# EAGLE design Placa Final (EAGLE 7.6.0)

## Sheet 1 of 10
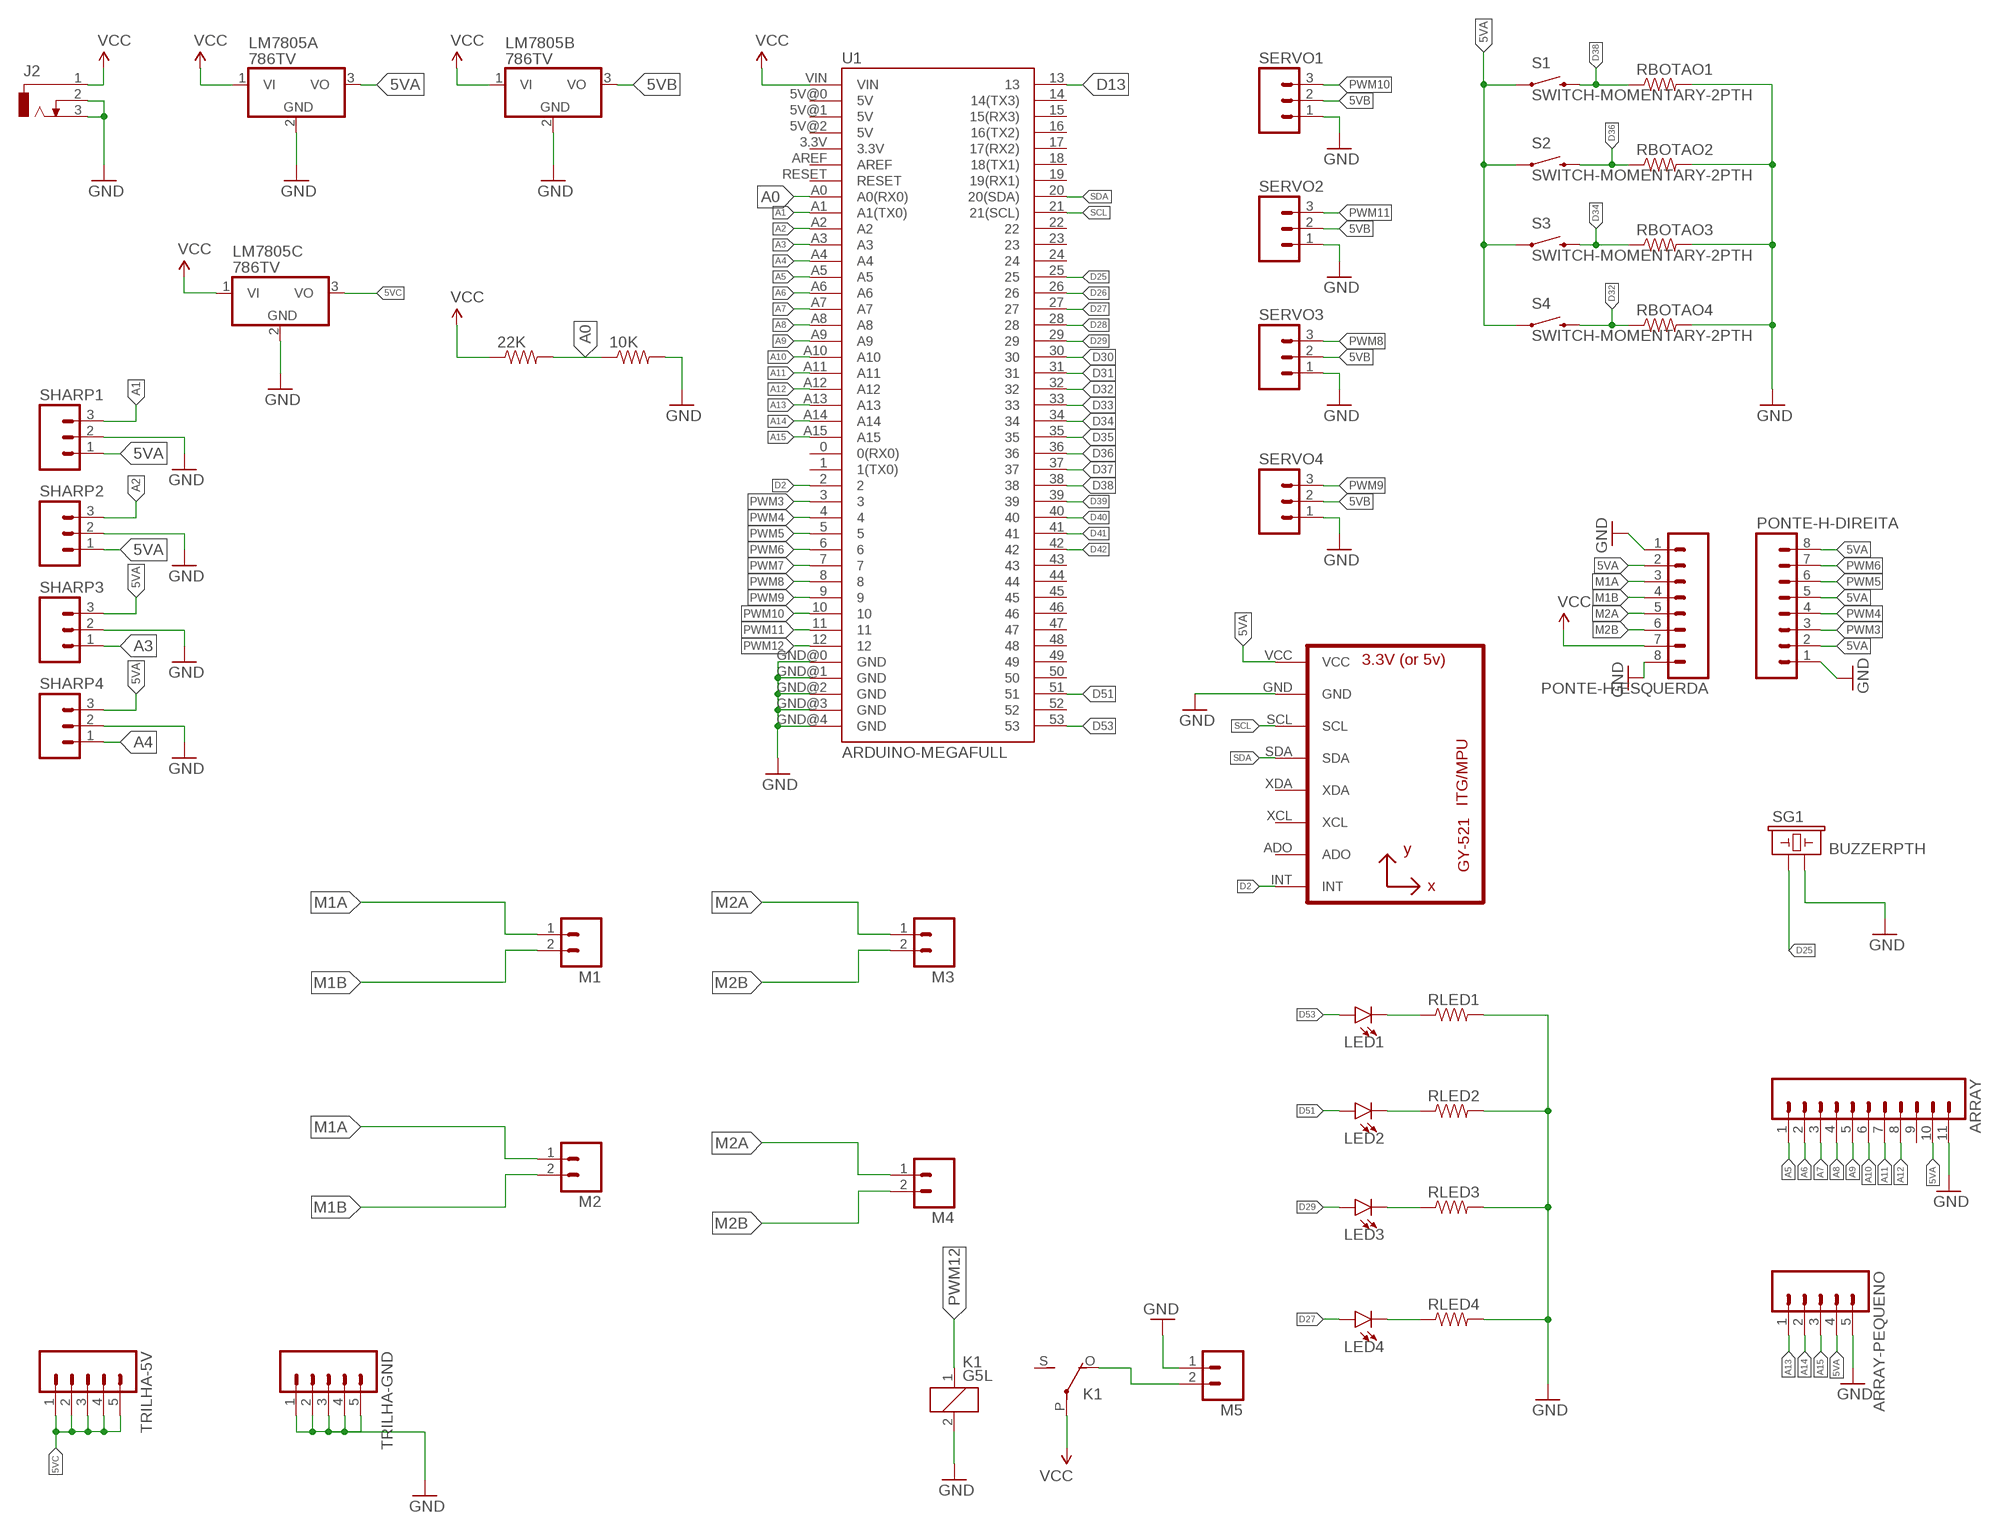
[diagram p0: schematic, sheet 1]

### Parts
10K  RESISTOREZ  [AXIAL-0.3EZ]
22K  RESISTOREZ  [AXIAL-0.3EZ]
ARRAY  M11POGOPIN_HOLES_ONLY  [1X11_HOLES_ONLY]
ARRAY-PEQUENO  M05PTH  [1X05]
J2  DCJ0303  [DCJ0303]
K1  G5L  [G5LE]
LED1  LED5MM  [LED_5MM]
LED2  LED5MM  [LED_5MM]
LED3  LED5MM  [LED_5MM]
LED4  LED5MM  [LED_5MM]
LM7805A  786TV  [TO220V]
LM7805B  786TV  [TO220V]
LM7805C  786TV  [TO220V]
M1  M02JST-PTH-VERT  [JST-2-PTH-VERT]
M2  M02JST-PTH-VERT  [JST-2-PTH-VERT]
M3  M02JST-PTH-VERT  [JST-2-PTH-VERT]
M4  M02JST-PTH-VERT  [JST-2-PTH-VERT]
M5  M02JST-PTH-VERT  [JST-2-PTH-VERT]
PONTE-H-DIREITA  M08NO_SILK  [1X08_PIN1_NO_SILK]
PONTE-H-ESQUERDA  M08NO_SILK  [1X08_PIN1_NO_SILK]
RBOTAO1  RESISTOREZ  [AXIAL-0.3EZ]
RBOTAO2  RESISTOREZ  [AXIAL-0.3EZ]
RBOTAO3  RESISTOREZ  [AXIAL-0.3EZ]
RBOTAO4  RESISTOREZ  [AXIAL-0.3EZ]
RLED1  RESISTOREZ  [AXIAL-0.3EZ]
RLED2  RESISTOREZ  [AXIAL-0.3EZ]
RLED3  RESISTOREZ  [AXIAL-0.3EZ]
RLED4  RESISTOREZ  [AXIAL-0.3EZ]
S1  SWITCH-MOMENTARY-2PTH  [TACTILE-PTH]
S2  SWITCH-MOMENTARY-2PTH  [TACTILE-PTH]
S3  SWITCH-MOMENTARY-2PTH  [TACTILE-PTH]
S4  SWITCH-MOMENTARY-2PTH  [TACTILE-PTH]
SERVO1  M03LONGPADS  [1X03_LONGPADS@1]
SERVO2  M03LONGPADS  [1X03_LONGPADS@1]
SERVO3  M03LONGPADS  [1X03_LONGPADS@1]
SERVO4  M03LONGPADS  [1X03_LONGPADS@1]
SG1  BUZZERPTH  [BUZZER-12MM]
SHARP1  M03LONGPADS  [1X03_LONGPADS@1]
SHARP2  M03LONGPADS  [1X03_LONGPADS@1]
SHARP3  M03LONGPADS  [1X03_LONGPADS@1]
SHARP4  M03LONGPADS  [1X03_LONGPADS@1]
TRILHA-5V  M05PTH  [1X05]
TRILHA-GND  M05PTH  [1X05]
U1  ARDUINO-MEGAFULL  [ARDUINO_MEGA]
U2  GY-521MPU6050  [GY-521]

### Nets
5VA: ARRAY-PEQUENO.4 ARRAY.10 LM7805A.3(VO) PONTE-H-DIREITA.2 PONTE-H-DIREITA.5 PONTE-H-DIREITA.8 PONTE-H-ESQUERDA.2 S1.1 S2.1 S3.1 S4.1 SHARP1.1 SHARP2.1 SHARP3.3 SHARP4.3 U2.VCC
5VB: LM7805B.3(VO) SERVO1.2 SERVO2.2 SERVO3.2 SERVO4.2
5VC: LM7805C.3(VO) TRILHA-5V.1 TRILHA-5V.2 TRILHA-5V.3 TRILHA-5V.4 TRILHA-5V.5
A0: 10K.P$1 22K.P$2 U1.A0(A0(RX0))
A1: SHARP1.3 U1.A1(A1(TX0))
A2: SHARP2.3 U1.A2
A3: SHARP3.1 U1.A3
A4: SHARP4.1 U1.A4
A5: ARRAY.1 U1.A5
A6: ARRAY.2 U1.A6
A7: ARRAY.3 U1.A7
A8: ARRAY.4 U1.A8
A9: ARRAY.5 U1.A9
A10: ARRAY.6 U1.A10
A11: ARRAY.7 U1.A11
A12: ARRAY.8 U1.A12
A13: ARRAY-PEQUENO.1 U1.A13
A14: ARRAY-PEQUENO.2 U1.A14
A15: ARRAY-PEQUENO.3 U1.A15
D2: U1.2 U2.INT
D13: U1.13
D25: SG1.+ U1.25
D26: U1.26
D27: LED4.A U1.27
D28: U1.28
D29: LED3.A U1.29
D30: U1.30
D31: U1.31
D32: RBOTAO4.P$1 S4.3 U1.32
D33: U1.33
D34: RBOTAO3.P$1 S3.3 U1.34
D35: U1.35
D36: RBOTAO2.P$1 S2.3 U1.36
D37: U1.37
D38: RBOTAO1.P$1 S1.3 U1.38
D39: U1.39
D40: U1.40
D41: U1.41
D42: U1.42
D51: LED2.A U1.51
D53: LED1.A U1.53
GND: 10K.P$2 ARRAY-PEQUENO.5 ARRAY.11 J2.2 J2.3 K1.2 LM7805A.2(GND) LM7805B.2(GND) LM7805C.2(GND) M5.1 PONTE-H-DIREITA.1 PONTE-H-ESQUERDA.1 PONTE-H-ESQUERDA.8 RBOTAO1.P$2 RBOTAO2.P$2 RBOTAO3.P$2 RBOTAO4.P$2 RLED1.P$2 RLED2.P$2 RLED3.P$2 RLED4.P$2 SERVO1.1 SERVO2.1 SERVO3.1 SERVO4.1 SG1.- SHARP1.2 SHARP2.2 SHARP3.2 SHARP4.2 TRILHA-GND.1 TRILHA-GND.2 TRILHA-GND.3 TRILHA-GND.4 TRILHA-GND.5 U1.GND@0(GND) U1.GND@1(GND) U1.GND@2(GND) U1.GND@3(GND) U1.GND@4(GND) U2.GND
M1A: M1.1 M2.1 PONTE-H-ESQUERDA.3
M1B: M1.2 M2.2 PONTE-H-ESQUERDA.4
M2A: M3.1 M4.1 PONTE-H-ESQUERDA.5
M2B: M3.2 M4.2 PONTE-H-ESQUERDA.6
N$1: LED1.K(C) RLED1.P$1
N$2: LED2.K(C) RLED2.P$1
N$3: LED3.K(C) RLED3.P$1
N$4: LED4.K(C) RLED4.P$1
N$41: K1.O(2:O) M5.2
PWM3: PONTE-H-DIREITA.3 U1.3
PWM4: PONTE-H-DIREITA.4 U1.4
PWM5: PONTE-H-DIREITA.6 U1.5
PWM6: PONTE-H-DIREITA.7 U1.6
PWM7: U1.7
PWM8: SERVO3.3 U1.8
PWM9: SERVO4.3 U1.9
PWM10: SERVO1.3 U1.10
PWM11: SERVO2.3 U1.11
PWM12: K1.1 U1.12
SCL: U1.21(21(SCL)) U2.SCL
SDA: U1.20(20(SDA)) U2.SDA
VCC: 22K.P$1 J2.1 K1.P(2:P) LM7805A.1(VI) LM7805B.1(VI) LM7805C.1(VI) PONTE-H-ESQUERDA.7 U1.VIN
Unconnected: ARRAY.9 K1.S(2:S) U1.0(0(RX0)) U1.1(1(TX0)) U1.3.3V U1.5V@0(5V) U1.5V@1(5V) U1.5V@2(5V) U1.14(14(TX3)) U1.15(15(RX3)) U1.16(16(TX2)) U1.17(17(RX2)) U1.18(18(TX1)) U1.19(19(RX1)) U1.22 U1.23 U1.24 U1.43 U1.44 U1.45 U1.46 U1.47 U1.48 U1.49 U1.50 U1.52 U1.AREF U1.RESET U2.ADO U2.XCL U2.XDA

## Sheet 2 of 10
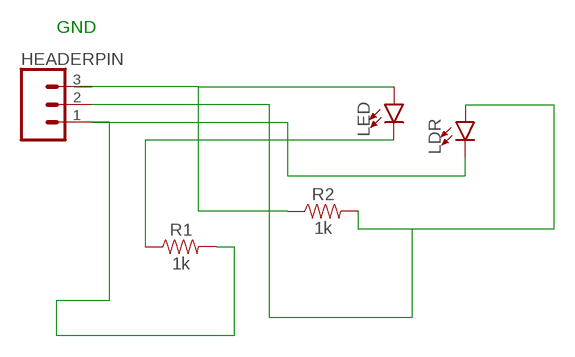
[diagram p1: schematic, sheet 2]

### Parts
HEADERPIN  CONN_03  [1X03]
LDR  LED5MM  [LED_5MM]
LED  LED5MM  [LED_5MM]
R1  1k  1KOHM-HORIZ-1/4W-5%  [AXIAL-0.3]
R2  1k  1KOHM-HORIZ-1/4W-5%  [AXIAL-0.3]

### Nets
N$5: HEADERPIN.3 LED.A R2.P$1
N$6: LED.K(C) R1.P$1
N$7: HEADERPIN.1 LDR.K(C) R1.P$2
N$8: HEADERPIN.2 LDR.A R2.P$2

### Notes on the sheet
- GND

## Sheet 3 of 10
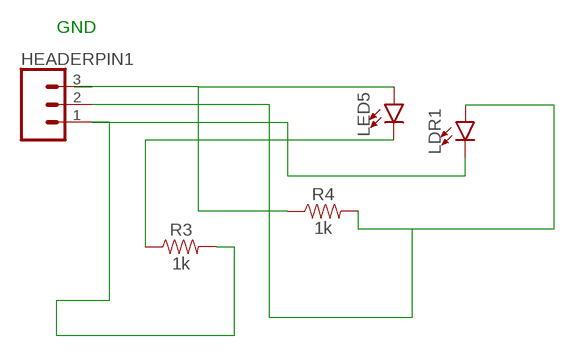
[diagram p2: schematic, sheet 3]

### Parts
HEADERPIN1  CONN_03  [1X03]
LDR1  LED5MM  [LED_5MM]
LED5  LED5MM  [LED_5MM]
R3  1k  1KOHM-HORIZ-1/4W-5%  [AXIAL-0.3]
R4  1k  1KOHM-HORIZ-1/4W-5%  [AXIAL-0.3]

### Nets
N$9: HEADERPIN1.3 LED5.A R4.P$1
N$10: LED5.K(C) R3.P$1
N$11: HEADERPIN1.1 LDR1.K(C) R3.P$2
N$12: HEADERPIN1.2 LDR1.A R4.P$2

### Notes on the sheet
- GND

## Sheet 4 of 10
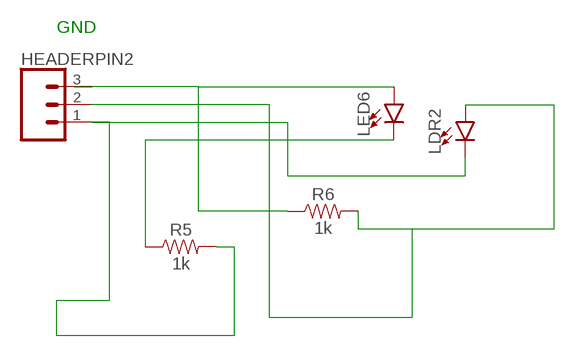
[diagram p3: schematic, sheet 4]

### Parts
HEADERPIN2  CONN_03  [1X03]
LDR2  LED5MM  [LED_5MM]
LED6  LED5MM  [LED_5MM]
R5  1k  1KOHM-HORIZ-1/4W-5%  [AXIAL-0.3]
R6  1k  1KOHM-HORIZ-1/4W-5%  [AXIAL-0.3]

### Nets
N$13: HEADERPIN2.3 LED6.A R6.P$1
N$14: LED6.K(C) R5.P$1
N$15: HEADERPIN2.1 LDR2.K(C) R5.P$2
N$16: HEADERPIN2.2 LDR2.A R6.P$2

### Notes on the sheet
- GND

## Sheet 5 of 10
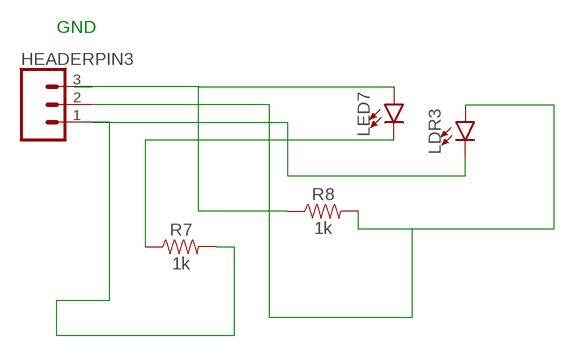
[diagram p4: schematic, sheet 5]

### Parts
HEADERPIN3  CONN_03  [1X03]
LDR3  LED5MM  [LED_5MM]
LED7  LED5MM  [LED_5MM]
R7  1k  1KOHM-HORIZ-1/4W-5%  [AXIAL-0.3]
R8  1k  1KOHM-HORIZ-1/4W-5%  [AXIAL-0.3]

### Nets
N$17: HEADERPIN3.3 LED7.A R8.P$1
N$18: LED7.K(C) R7.P$1
N$19: HEADERPIN3.1 LDR3.K(C) R7.P$2
N$20: HEADERPIN3.2 LDR3.A R8.P$2

### Notes on the sheet
- GND

## Sheet 6 of 10
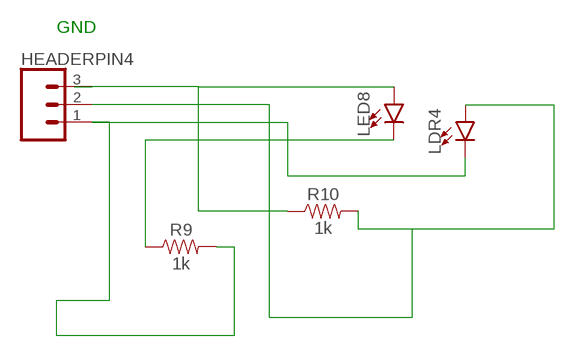
[diagram p5: schematic, sheet 6]

### Parts
HEADERPIN4  CONN_03  [1X03]
LDR4  LED5MM  [LED_5MM]
LED8  LED5MM  [LED_5MM]
R9  1k  1KOHM-HORIZ-1/4W-5%  [AXIAL-0.3]
R10  1k  1KOHM-HORIZ-1/4W-5%  [AXIAL-0.3]

### Nets
N$21: HEADERPIN4.3 LED8.A R10.P$1
N$22: LED8.K(C) R9.P$1
N$23: HEADERPIN4.1 LDR4.K(C) R9.P$2
N$24: HEADERPIN4.2 LDR4.A R10.P$2

### Notes on the sheet
- GND

## Sheet 7 of 10
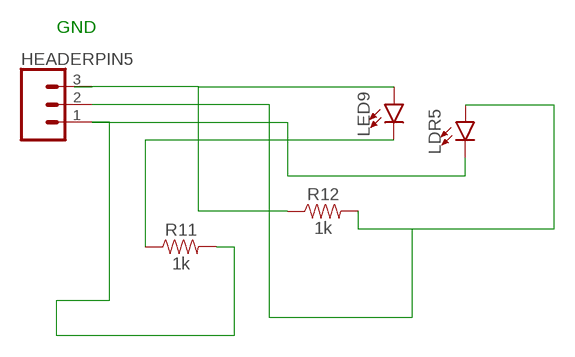
[diagram p6: schematic, sheet 7]

### Parts
HEADERPIN5  CONN_03  [1X03]
LDR5  LED5MM  [LED_5MM]
LED9  LED5MM  [LED_5MM]
R11  1k  1KOHM-HORIZ-1/4W-5%  [AXIAL-0.3]
R12  1k  1KOHM-HORIZ-1/4W-5%  [AXIAL-0.3]

### Nets
N$25: HEADERPIN5.3 LED9.A R12.P$1
N$26: LED9.K(C) R11.P$1
N$27: HEADERPIN5.1 LDR5.K(C) R11.P$2
N$28: HEADERPIN5.2 LDR5.A R12.P$2

### Notes on the sheet
- GND

## Sheet 8 of 10
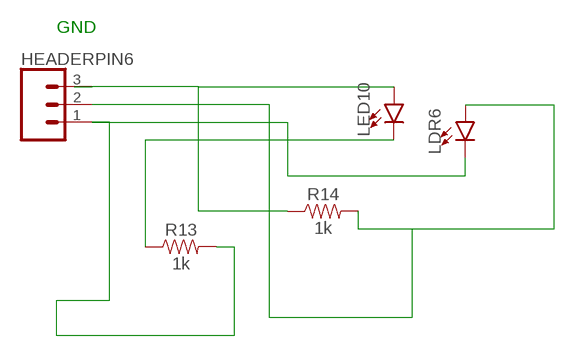
[diagram p7: schematic, sheet 8]

### Parts
HEADERPIN6  CONN_03  [1X03]
LDR6  LED5MM  [LED_5MM]
LED10  LED5MM  [LED_5MM]
R13  1k  1KOHM-HORIZ-1/4W-5%  [AXIAL-0.3]
R14  1k  1KOHM-HORIZ-1/4W-5%  [AXIAL-0.3]

### Nets
N$29: HEADERPIN6.3 LED10.A R14.P$1
N$30: LED10.K(C) R13.P$1
N$31: HEADERPIN6.1 LDR6.K(C) R13.P$2
N$32: HEADERPIN6.2 LDR6.A R14.P$2

### Notes on the sheet
- GND

## Sheet 9 of 10
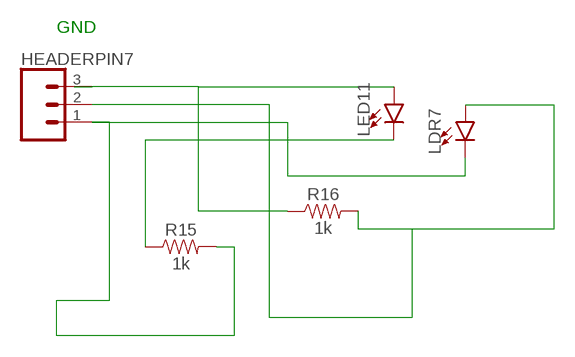
[diagram p8: schematic, sheet 9]

### Parts
HEADERPIN7  CONN_03  [1X03]
LDR7  LED5MM  [LED_5MM]
LED11  LED5MM  [LED_5MM]
R15  1k  1KOHM-HORIZ-1/4W-5%  [AXIAL-0.3]
R16  1k  1KOHM-HORIZ-1/4W-5%  [AXIAL-0.3]

### Nets
N$33: HEADERPIN7.3 LED11.A R16.P$1
N$34: LED11.K(C) R15.P$1
N$35: HEADERPIN7.1 LDR7.K(C) R15.P$2
N$36: HEADERPIN7.2 LDR7.A R16.P$2

### Notes on the sheet
- GND

## Sheet 10 of 10
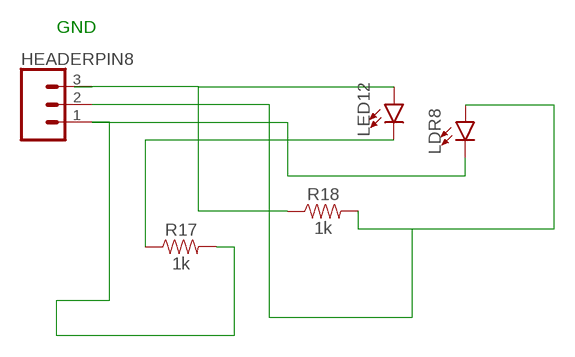
[diagram p9: schematic, sheet 10]

### Parts
HEADERPIN8  CONN_03  [1X03]
LDR8  LED5MM  [LED_5MM]
LED12  LED5MM  [LED_5MM]
R17  1k  1KOHM-HORIZ-1/4W-5%  [AXIAL-0.3]
R18  1k  1KOHM-HORIZ-1/4W-5%  [AXIAL-0.3]

### Nets
N$37: HEADERPIN8.3 LED12.A R18.P$1
N$38: LED12.K(C) R17.P$1
N$39: HEADERPIN8.1 LDR8.K(C) R17.P$2
N$40: HEADERPIN8.2 LDR8.A R18.P$2

### Notes on the sheet
- GND

## Library data of the parts
10K 22K RBOTAO1-RBOTAO4 RLED1-RLED4 = SparkFun-Passives:RESISTOR: Resistor Basic schematic elements and footprints for 0603, 1206, and PTH resistors.
ARRAY = SparkFun-Connectors:M11: Header 11 Standard 11-pin 0.1" header. Use with straight break away headers (SKU : PRT-00116), right angle break away headers (PRT-00553), swiss pins (PRT-00743), machine pins (PRT-00117), and female headers (PRT-00115).
ARRAY-PEQUENO TRILHA-5V TRILHA-GND = SparkFun-Connectors:M05: Header 5 Standard 5-pin 0.1" header. Use with straight break away headers (SKU : PRT-00116), right angle break away headers (PRT-00553), swiss pins (PRT-00743), machine pins (PRT-00117), and female headers (PRT-00115). Molex polarized connector foot print use with SKU : PRT-08230 with associated crimp pins and housings.
HEADERPIN HEADERPIN1-HEADERPIN8 = SparkFun-Connectors:CONN_03: Multi connection point. Often used as Generic Header-pin footprint for 0.1 inch spaced/style header connections On any of the 0.1 inch spaced packages, you can populate with these: Break Away Headers - Straight <https://www.sparkfun.com/products/116> (PRT-00116) Break Away Male Headers - Right Angle <https://www.sparkfun.com/products/553> (PRT-00553) Female Headers <https://www.sparkfun.com/products/115> (PRT-00115) Break Away Headers - Machine Pin <https://www.sparkfun.com/products/117> (PRT-00117) Break Away Female Headers - Swiss Machine Pin <https://www.sparkfun.com/products/743> (PRT-00743) Stackable Header - 3 Pin (Female, 0.1") <https://www.sparkfun.com/products/13875> (PRT-13875) For SCREWTERMINALS and SPRING TERMINALS visit here: Screw Terimnals on SparkFun.com <https://www.sparkfun.com/search/results?term=Screw+Terminals> (5mm/3.5mm/2.54mm spacing) This device is also useful as a general connection point to wire up your design to another part of your project. Our various solder wires solder well into these plated through hole pads. Hook-Up Wire - Assortment (Stranded, 22 AWG) <https://www.sparkfun.com/products/11375> (PRT-11375) Hook-Up Wire - Assortment (Solid Core, 22 AWG) <https://www.sparkfun.com/products/11367> (PRT-11367) View the entire wire category on our website here <https://www.sparkfun.com/categories/141> Special notes: Molex polarized connector foot print use with SKU : PRT-08232 with associated crimp pins and housings.
J2 = con-jack:DCJ0303: DC POWER JACK Source: DCJ0303.pdf; OC_FARNELL: unknown; OC_NEWARK: unknown
K1 = relay:G5L: RELAY 1 x switch, 10 A/120 V AC, 8 A/30 V ADC, Omron
LDR LDR1-LDR8 LED LED1-LED12 = SparkFun-LED:LED: LED (Generic) Standard schematic elements and footprints for 5mm, 3mm, 1206, and 0603 sized LEDs. Generic LEDs with no color specified.
LM7805A LM7805B LM7805C = linear:78*: Positive VOLTAGE REGULATOR Source: http://cache.national.com/ds/LM/LM78L05.pdf http://www.fairchildsemi.com/ds/LM/LM7805.pdf
M1-M5 = SparkFun-Connectors:M02: Standard 2-pin 0.1" header. Use with - straight break away headers ( PRT-00116) - right angle break away headers (PRT-00553) - swiss pins (PRT-00743) - machine pins (PRT-00117) - female headers (PRT-00115) Molex polarized connector foot print use with: PRT-08233 with associated crimp pins and housings. 2.54_SCREWTERM for use with PRT-10571. 3.5mm Screw Terminal footprints for PRT-08084 5mm Screw Terminal footprints for use with PRT-08432
PONTE-H-DIREITA PONTE-H-ESQUERDA = SparkFun-Connectors:M08: Header 8 Standard 8-pin 0.1" header. Use with straight break away headers (SKU : PRT-00116), right angle break away headers (PRT-00553), swiss pins (PRT-00743), machine pins (PRT-00117), and female headers (PRT-00115).
R1-R18 = SparkFun-Resistors:1KOHM: 1kΩ resistor A resistor is a passive two-terminal electrical component that implements electrical resistance as a circuit element. Resistors act to reduce current flow, and, at the same time, act to lower voltage levels within circuits. - Wikipedia; PROD_ID: RES-08380
S1-S4 = SparkFun-Electromechanical:SWITCH-MOMENTARY-2: Various NO switches- pushbuttons, reed, etc; PROD_ID: SWCH-08441
SERVO1-SERVO4 SHARP1-SHARP4 = SparkFun-Connectors:M03: Header 3 Standard 3-pin 0.1" header. Use with straight break away headers (SKU : PRT-00116), right angle break away headers (PRT-00553), swiss pins (PRT-00743), machine pins (PRT-00117), and female headers (PRT-00115). Molex polarized connector foot print use with SKU : PRT-08232 with associated crimp pins and housings.
SG1 = SparkFun-Electromechanical:BUZZER: Buzzer 12mm Spark Fun Electronics SKU : Comp-Buzzer
U1 = SparkFun-Boards:ARDUINO-MEGA: Arduino Mega board footprint
U2 = gy-521:GY-521

## Board
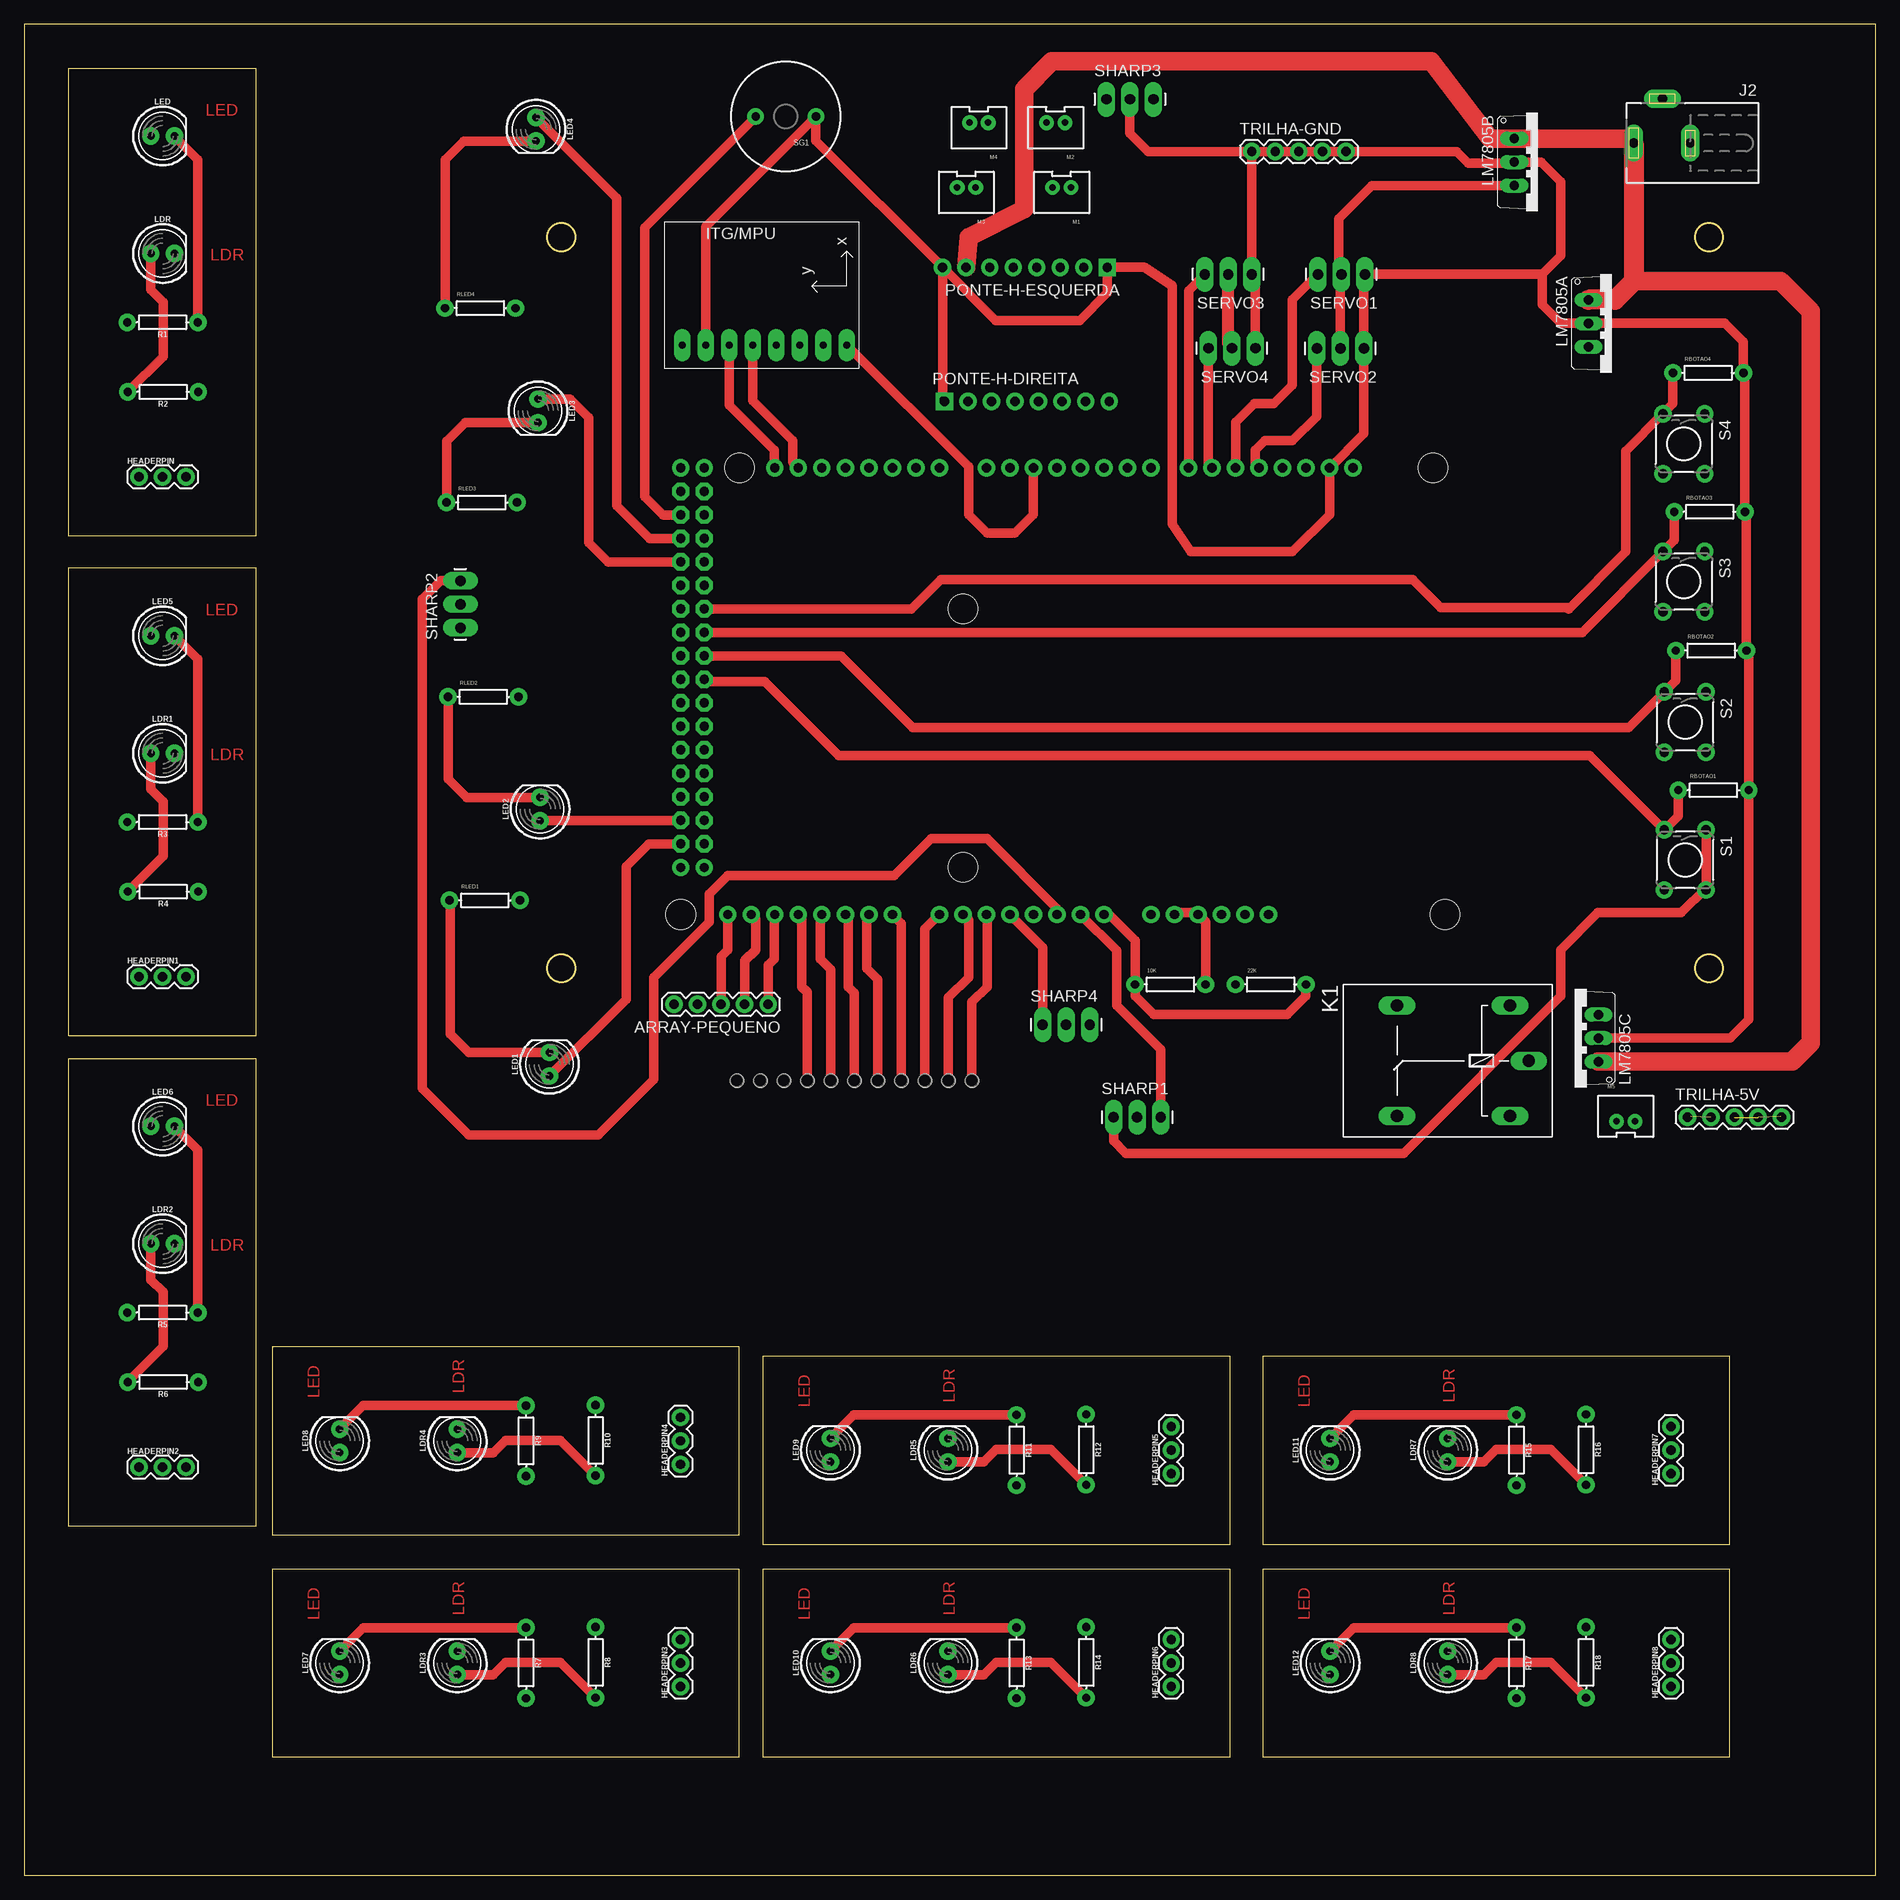
[diagram p10: board, top side]
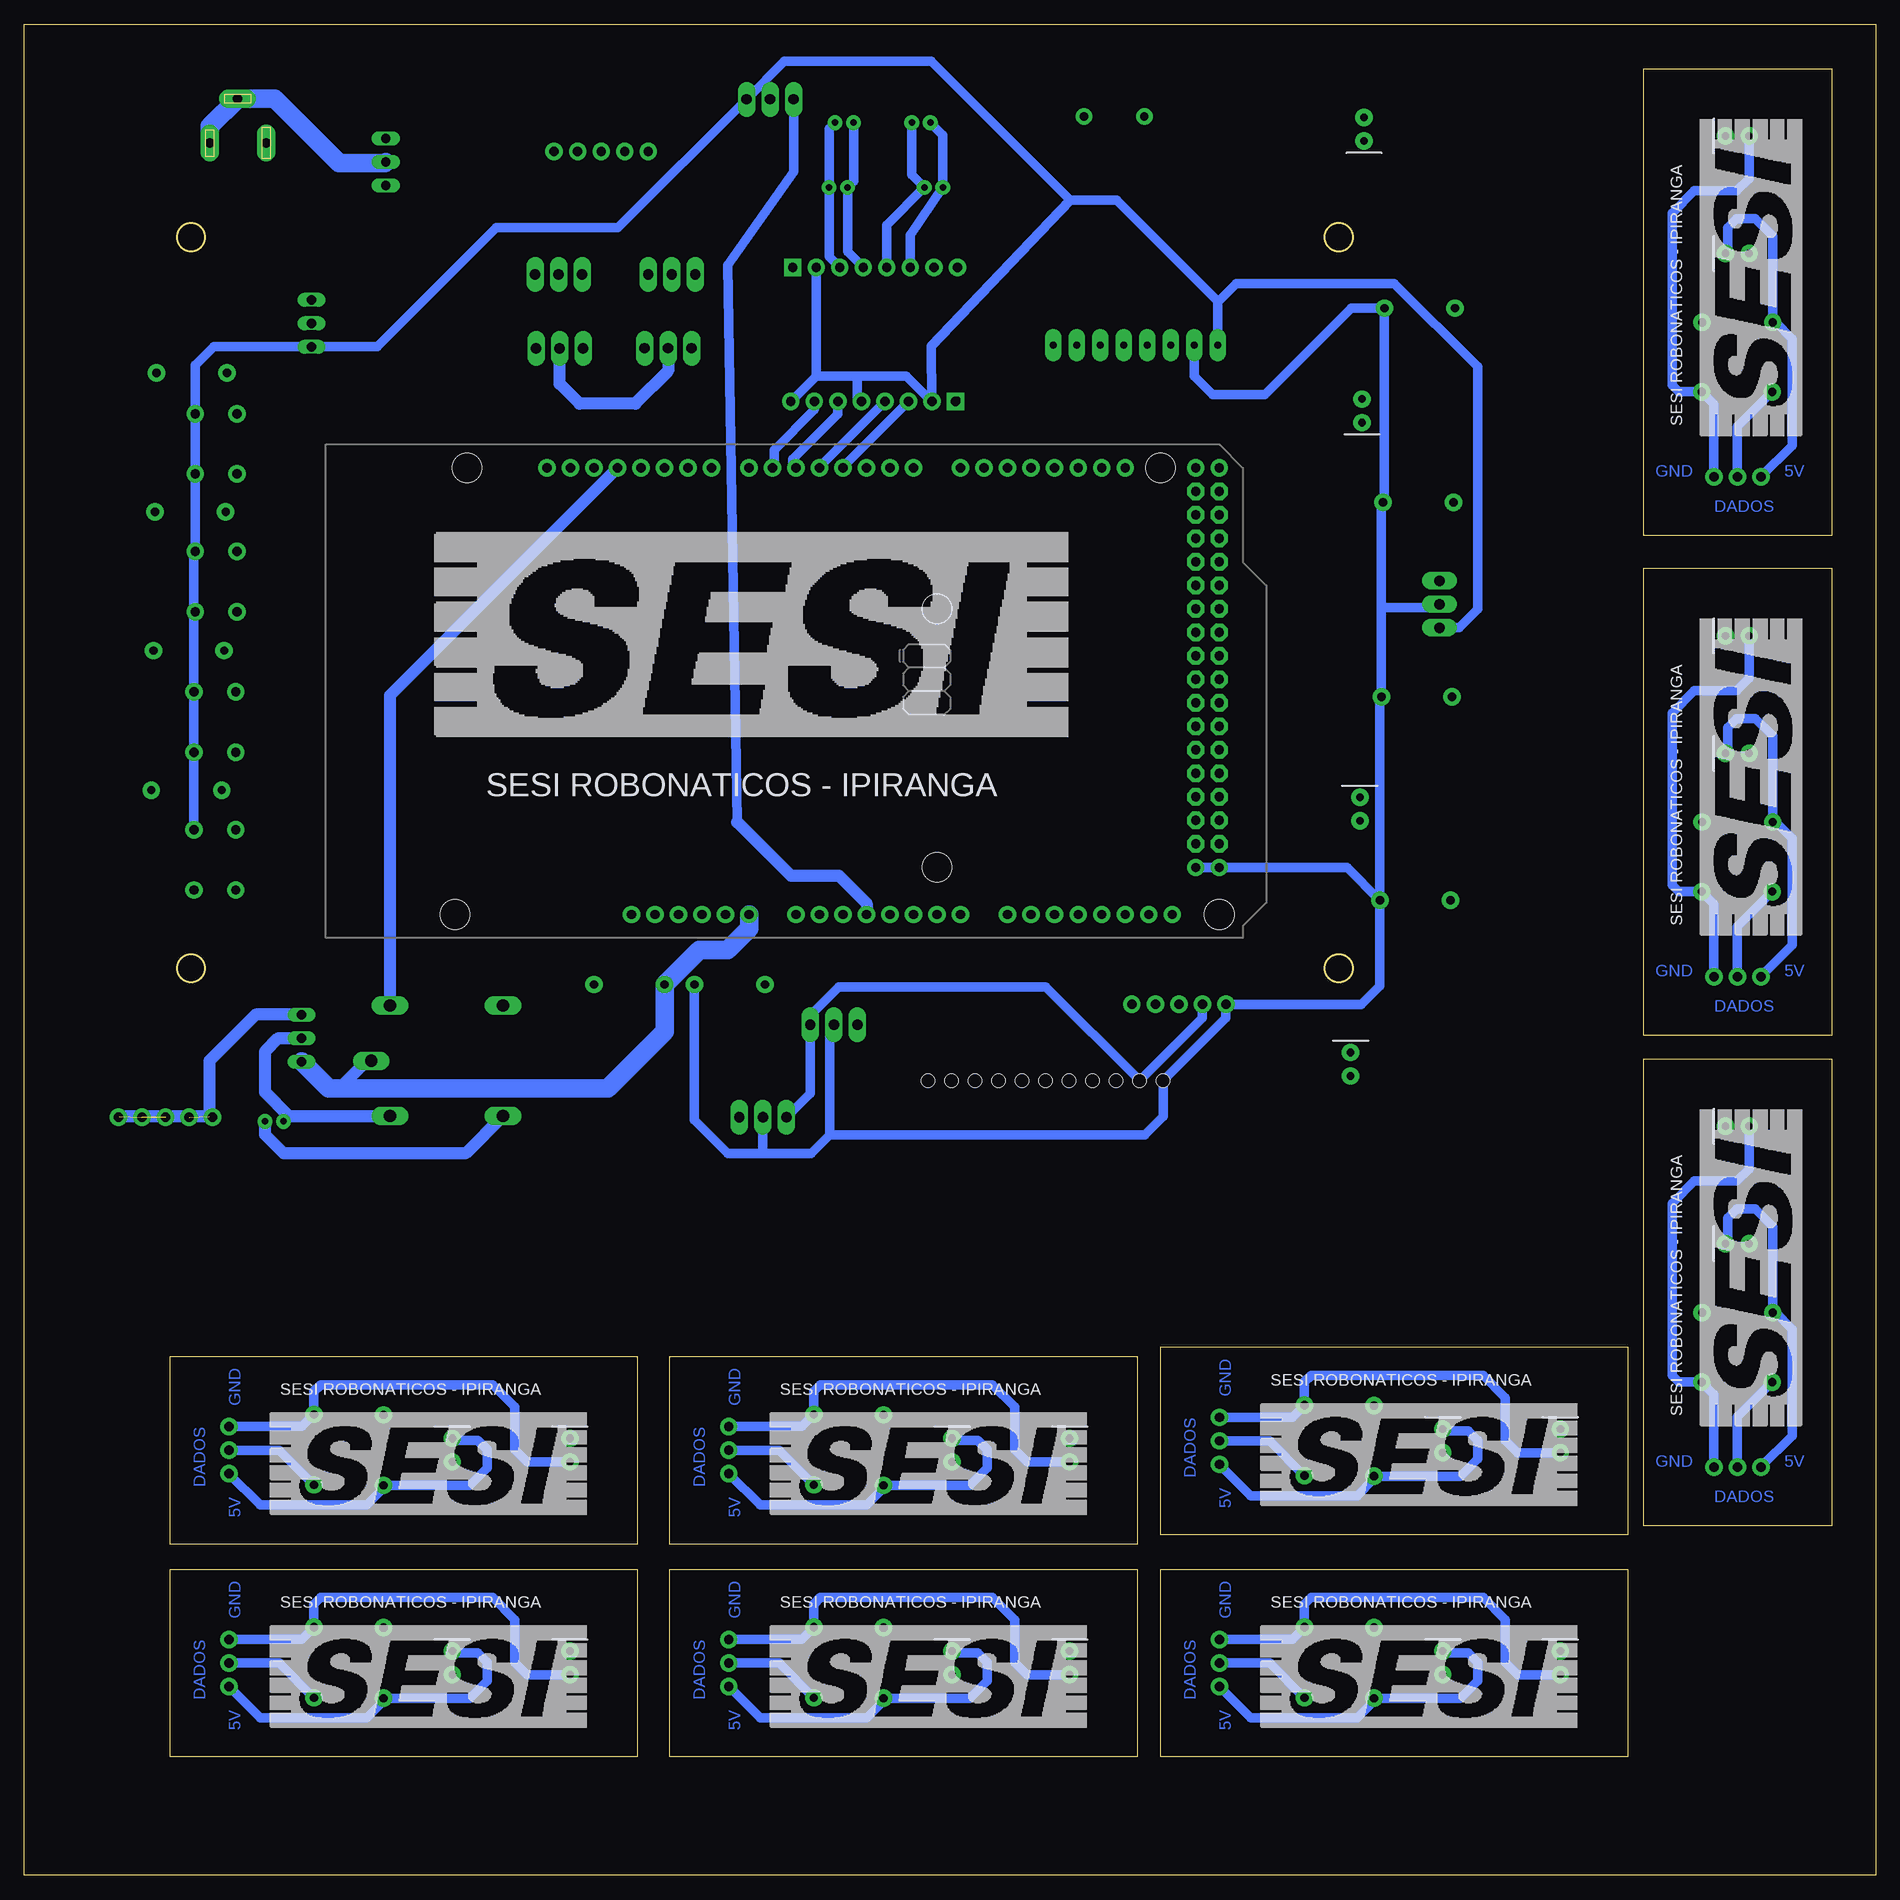
[diagram p11: board, bottom side, seen from below]

Size 200 x 200 mm. Coordinates in mm from the lower left corner, seen from the top.
Outline: 0,200 0,0 200,0 200,200 0,200
Outline: 4.77,144.75 25.07,144.75 25.07,195.22 4.77,195.22 4.77,144.75
Outline: 4.77,90.75 25.07,90.75 25.07,141.22 4.77,141.22 4.77,90.75
Outline: 4.77,37.75 25.07,37.75 25.07,88.22 4.77,88.22 4.77,37.75
Outline: 77.25,12.77 77.25,33.07 26.78,33.07 26.78,12.77 77.25,12.77
Outline: 77.25,36.77 77.25,57.07 26.78,57.07 26.78,36.77 77.25,36.77
Outline: 130.25,35.77 130.25,56.07 79.78,56.07 79.78,35.77 130.25,35.77
Outline: 130.25,12.77 130.25,33.07 79.78,33.07 79.78,12.77 130.25,12.77
Outline: 184.25,35.77 184.25,56.07 133.78,56.07 133.78,35.77 184.25,35.77
Outline: 184.25,12.77 184.25,33.07 133.78,33.07 133.78,12.77 184.25,12.77
Outline: circle at 58,177 radius 1.5
Outline: circle at 58,98 radius 1.5
Outline: circle at 182,177 radius 1.5
Outline: circle at 182,98 radius 1.5
Copper layers (1*16): Top 0.035mm / dielectric 1.5mm / Bottom 0.035mm
Design rules "default": minimum track width 10mil, minimum drill 24mil, track to track 8mil, track to pad 8mil, pad to pad 8mil, via to via 8mil, smd to smd 8mil, copper to edge 40mil, drill to drill 8mil, minimum pad ring 10mil, minimum via ring 8mil, stop-mask expansion 4mil, vias tented up to drill 0mil, thermal gap 10mil

### Footprints (pad centres in the part's own frame; a part is rotated, then mirrored left to right if it is on the bottom)
AXIAL-0.3EZ = drill 0.9 pad 1.88: P$1 -3.81,0; P$2 3.81,0
1X11_HOLES_ONLY = drill 0.889 pad 0.813: 1 0,0; 2 2.54,0; 3 5.08,0; 4 7.62,0; 5 10.16,0; 6 12.7,0; 7 15.24,0; 8 17.78,0; 9 20.32,0; 10 22.86,0; 11 25.4,0 | hole 1.473: 0,0; 2.54,0; 5.08,0; 7.62,0; 10.16,0; 12.7,0; 15.24,0; 17.78,0; 20.32,0; 22.86,0; 25.4,0
1X05 = drill 1.016 pad 1.88: 1 0,0; 2 2.54,0; 3 5.08,0; 4 7.62,0; 5 10.16,0
1X03 = drill 1.016 pad 1.88: 1 0,0; 2 2.54,0; 3 5.08,0
DCJ0303 = drill 1 pad 2 long: 1 0,3.1; 2 4.8,0; 3 0,-3
G5LE = drill 1.321 long: 1 -7.493,-5.969; 2 -7.493,5.969; O 4.699,5.969; P -9.525,0; S 4.699,-5.969
LED_5MM = drill 0.813 pad 1.88: A -1.27,0; K 1.27,0
TO220V = drill 1.016 long: 1 -2.54,-2.54; 2 0,-2.54; 3 2.54,-2.54
JST-2-PTH-VERT = drill 0.7 pad 1.6: 1 -1,-0.55; 2 1,-0.55
1X08_PIN1_NO_SILK = drill 1.016 pad 1.88 square: 1 0,0 | drill 1.016 pad 1.88: 2 2.54,0; 3 5.08,0; 4 7.62,0; 5 10.16,0; 6 12.7,0; 7 15.24,0; 8 17.78,0
AXIAL-0.3 = drill 0.9 pad 1.88: P$1 -3.81,0; P$2 3.81,0
TACTILE-PTH = drill 1.016 pad 1.88: 1 -3.251,2.261; 2 3.251,2.261; 3 -3.251,-2.261; 4 3.251,-2.261
1X03_LONGPADS@1 = drill 1.118 pad 1.88 long: 1 0,0; 2 2.54,0; 3 5.08,0
BUZZER-12MM = drill 0.9 pad 1.778: + 3.25,0; - -3.25,0
ARDUINO_MEGA = drill 1.016 pad 1.88: 0 63.5,50.8; 1 60.96,50.8; 2 58.42,50.8; 3 55.88,50.8; 3.3V 35.56,2.54; 4 53.34,50.8; 5 50.8,50.8; 5V@0 38.1,2.54; 5V@1 93.98,50.8; 5V@2 96.52,50.8; 6 48.26,50.8; 7 45.72,50.8; 8 41.656,50.8; 9 39.116,50.8; 10 36.576,50.8; 11 34.036,50.8; 12 31.496,50.8; 13 28.956,50.8; 14 68.58,50.8; 15 71.12,50.8; 16 73.66,50.8; 17 76.2,50.8; 18 78.74,50.8; 19 81.28,50.8; 20 83.82,50.8; 21 86.36,50.8; A0 50.8,2.54; A1 53.34,2.54; A2 55.88,2.54; A3 58.42,2.54; A4 60.96,2.54; A5 63.5,2.54; A6 66.04,2.54; A7 68.58,2.54; A8 73.66,2.54; A9 76.2,2.54; A10 78.74,2.54; A11 81.28,2.54; A12 83.82,2.54; A13 86.36,2.54; A14 88.9,2.54; A15 91.44,2.54; AREF 23.876,50.8; GND@0 40.64,2.54; GND@1 43.18,2.54; GND@2 93.98,7.62; GND@3 96.52,7.62; GND@4 26.416,50.8; RESET 33.02,2.54; VIN 45.72,2.54 | drill 1.016 pad 1.88 octagon: 22 93.98,48.26; 23 96.52,48.26; 24 93.98,45.72; 25 96.52,45.72; 26 93.98,43.18; 27 96.52,43.18; 28 93.98,40.64; 29 96.52,40.64; 30 93.98,38.1; 31 96.52,38.1; 32 93.98,35.56; 33 96.52,35.56; 34 93.98,33.02; 35 96.52,33.02; 36 93.98,30.48; 37 96.52,30.48; 38 93.98,27.94; 39 96.52,27.94; 40 93.98,25.4; 41 96.52,25.4; 42 93.98,22.86; 43 96.52,22.86; 44 93.98,20.32; 45 96.52,20.32; 46 93.98,17.78; 47 96.52,17.78; 48 93.98,15.24; 49 96.52,15.24; 50 93.98,12.7; 51 96.52,12.7; 52 93.98,10.16; 53 96.52,10.16 | hole 3.2: 15.24,50.8; 13.97,2.54; 66.04,35.56; 66.04,7.62; 90.17,50.8; 96.52,2.54
GY-521 = drill 0.8 pad 1.778 long: ADO -8.89,-6.35; GND -8.89,6.35; INT -8.89,-8.89; SCL -8.89,3.81; SDA -8.89,1.27; VCC -8.89,8.89; XCL -8.89,-3.81; XDA -8.89,-1.27

### Placement (x,y rotation side)
10K  123.8,96.25 0 top
22K  134.64,96.25 0 top
ARRAY  102.37,85.86 180 top
ARRAY-PEQUENO  80.36,94.1 180 top
HEADERPIN  12.39,151.1 0 top
HEADERPIN1  12.39,97.1 0 top
HEADERPIN2  12.39,44.1 0 top
HEADERPIN3  70.9,20.39 90 top
HEADERPIN4  70.9,44.39 90 top
HEADERPIN5  123.9,43.39 90 top
HEADERPIN6  123.9,20.39 90 top
HEADERPIN7  177.9,43.39 90 top
HEADERPIN8  177.9,20.39 90 top
J2  176.96,187.17 90 top
K1  153,88 180 top
LDR  14.93,175.23 0 top
LDR1  14.93,121.23 0 top
LDR2  14.93,68.23 0 top
LDR3  46.77,22.93 90 top
LDR4  46.77,46.93 90 top
LDR5  99.77,45.93 90 top
LDR6  99.77,22.93 90 top
LDR7  153.77,45.93 90 top
LDR8  153.77,22.93 90 top
LED  14.93,187.93 0 top
LED1  56.72,87.63 90 top
LED2  55.72,115.2 90 top
LED3  55.5,158.23 270 top
LED4  55.28,188.66 270 top
LED5  14.93,133.93 0 top
LED6  14.93,80.93 0 top
LED7  34.07,22.93 90 top
LED8  34.07,46.93 90 top
LED9  87.07,45.93 90 top
LED10  87.07,22.93 90 top
LED11  141.07,45.93 90 top
LED12  141.07,22.93 90 top
LM7805A  171.5,167.69 270 top
LM7805B  163.5,185.12 270 top
LM7805C  167.5,90.45 90 top
M1  112.07,181.83 180 top
M2  111.42,188.83 180 top
M3  101.77,181.83 180 top
M4  103.12,188.83 180 top
M5  173,82 0 top
PONTE-H-DIREITA  99.42,159.25 0 top
PONTE-H-ESQUERDA  116.99,173.75 180 top
R1  14.93,167.8 180 top
R2  14.98,160.29 180 top
R3  14.93,113.8 180 top
R4  14.98,106.29 180 top
R5  14.93,60.8 180 top
R6  14.98,53.29 180 top
R7  54.2,22.93 270 top
R8  61.71,22.98 270 top
R9  54.2,46.93 270 top
R10  61.71,46.98 270 top
R11  107.2,45.93 270 top
R12  114.71,45.98 270 top
R13  107.2,22.93 270 top
R14  114.71,22.98 270 top
R15  161.2,45.93 270 top
R16  168.71,45.98 270 top
R17  161.2,22.93 270 top
R18  168.71,22.98 270 top
RBOTAO1  182.48,117.25 0 top
RBOTAO2  182.22,132.33 0 top
RBOTAO3  182.06,147.33 0 top
RBOTAO4  181.9,162.33 0 top
RLED1  49.74,105.33 0 top
RLED2  49.58,127.33 0 top
RLED3  49.42,148.33 0 top
RLED4  49.26,169.33 0 top
S1  179.42,109.71 270 top
S2  179.42,124.6 270 top
S3  179.28,139.78 270 top
S4  179.28,154.67 270 top
SERVO1  144.82,172.99 180 top
SERVO2  144.71,164.99 180 top
SERVO3  132.6,172.99 180 top
SERVO4  133,165 180 top
SG1  82.26,190.04 180 top
SHARP1  117.68,81.9 0 top
SHARP2  47.1,134.79 90 top
SHARP3  116.9,191.9 0 top
SHARP4  110.01,91.9 0 top
TRILHA-5V  179.67,81.9 0 top
TRILHA-GND  132.6,186.25 0 top
U1  167.43,101.27 0 bottom
U2  79.96,174.22 90 top

### Tracks (layer width: path | path; a pad name or v marks a point on that pad's centre or on a via)
5VA
  Top 1: S1.1 181.68,106.68 179,104 170,104 166,100 166,95 149,78 119,78 117.68,79.32 SHARP1.1
  Bottom 1: ARRAY-PEQUENO.4 72.74,92.63 ARRAY.10 89.65,96 112,96 115.09,92.91 SHARP4.3 115.09,84.49 SHARP1.1 | U2.VCC 71.07,170 | 71.07,170 71.07,170.07 82,181 87,181 | 87,181 102,196 117.88,196 SHARP3.3 135.88,178 149,178 161.85,165.15 LM7805A.3 179.54,165.15 181.54,163.15 S4.1 S3.1 181.68,142.89 S2.1 S1.1 | SHARP2.1 45,134.79 43,136.79 43,163 52,172 69.07,172 71.07,170 | 87,181 102,165.21 PONTE-H-DIREITA.2 104.71,162 110,162 | PONTE-H-DIREITA.8 114.45,162 | 114.45,162 PONTE-H-ESQUERDA.2 | 110,162 114.45,162 | PONTE-H-DIREITA.5 110,159.67 110,162
5VB
  Top 1: LM7805B.3 145.58,182.58 142,179 142,173.27 SERVO1.2 142.17,172.99 SERVO2.2
  Top 1.27: SERVO4.2 130.06,165.4 SERVO3.2
  Bottom 1.27: SERVO4.2 130.46,162.54 134,159 140,159 142.17,161.17 SERVO2.2
5VC  (3 unrouted)
  Bottom 1.27: LM7805C.3 175.01,92.99 180,88 180,82 | 180,82 179.77,82 TRILHA-5V.1 | 180,82 189.73,82 TRILHA-5V.5
A0
  Top 1: U1.A0 116.81,103.81 117,104 119.99,101.01 10K.P$1 119.99,95 121.99,93 136.45,93 138.45,95 22K.P$2
A1
  Top 1: U1.A1 118,99.9 118,94 122.76,89.24 SHARP1.3
A2
  Top 1: U1.A2 111.55,104.45 104,112 98,112 94,108 76,108 74,106 74,103 68,97 68,86 62,80 48,80 43,85 43,137.87 45,139.87 SHARP2.3
A3
  Bottom 1: 123,113.8 124,174 116.9,184.1 SHARP3.1
  Bottom 1.27: 123,113.8 117.2,108 112,108 109.01,105.01 U1.A3
A4
  Top 1: SHARP4.1 110.01,100.27 U1.A4
A5
  Top 1: ARRAY.1 102.37,94.37 104,96 104,103.74 U1.A5
A6
  Top 1: ARRAY.2 99.83,94.83 102,97 102,103.2 U1.A6
A7
  Top 1: ARRAY.3 97.29,102.25 U1.A7
A8
  Top 1: ARRAY.4 94.75,102.83 U1.A8
A9
  Top 1: ARRAY.5 92.21,96.79 91,98 91,103.58 U1.A9
A10
  Top 1: ARRAY.6 89.67,95.33 89,96 89,103.5 U1.A10
A11
  Top 1: ARRAY.7 87.13,97.87 86,99 86,103.66 U1.A11
A12
  Top 1: ARRAY.8 84.59,95.41 84,96 84,103.42 U1.A12
A13
  Top 1: ARRAY-PEQUENO.1 80.36,98.36 81,99 81,103.74 U1.A13
A14
  Top 1: ARRAY-PEQUENO.2 77.82,98.82 79,100 79,103.34 U1.A14
A15
  Top 1: ARRAY-PEQUENO.3 75.28,99.28 76,100 U1.A15
D2
  Top 1: U2.INT 102,152.18 102,147 104,145 107,145 109.01,147.01 U1.2
D25
  Top 1: SG1.+ 67,178.03 67,148.99 69,146.99 U1.25
D27
  Top 1: LED4.A 64,181.21 64,148 67.55,144.45 U1.27
D29
  Top 1: LED3.A 59,159.5 61,157.5 61,144 63.09,141.91 U1.29
D32
  Top 1: RBOTAO4.P$1 178.09,158.99 S4.3 173,153.9 173,143 166.83,136.83 166.66,137 153,137 150,140 99,140 95.83,136.83 U1.32
D34
  Top 1: RBOTAO3.P$1 178.25,144.26 S3.3 168.28,134.29 U1.34
D36
  Top 1: RBOTAO2.P$1 178.41,129.1 S2.3 173.31,124 96,124 88.25,131.75 U1.36
D38
  Top 1: RBOTAO1.P$1 178.67,114.47 S1.3 169.12,121 88,121 80,129 73,129 73.21,129.21 U1.38
D51
  Top 1: LED2.A 55.76,113.97 U1.51
D53
  Top 1: LED1.A 65,94.64 65,109 67.43,111.43 U1.53
GND  (via drill 0.6)
  Top 1: U1.GND@1 124.19,103.81 124,104 126.6,104 U1.GND@0 127.61,102.99 10K.P$2 | TRILHA-GND.1 TRILHA-GND.2 TRILHA-GND.3 TRILHA-GND.4 | TRILHA-GND.4 TRILHA-GND.5 154.75,186.25 156,185 160.84,185 LM7805B.2 163.88,185.12 166,183 166,174.99 164,172.99 | SERVO4.1 133,172.59 SERVO3.1 TRILHA-GND.1 | 164,172.99 SERVO1.1 144.71,172.88 SERVO2.1 144.71,155.77 U1.GND@4 141.01,147.01 137,143 126,143 124,146 124,171.75 121,173.75 PONTE-H-ESQUERDA.1 116.99,170.99 114,168 104.96,168 PONTE-H-ESQUERDA.8 | TRILHA-GND.1 121.44,186.25 119.44,188.25 SHARP3.2 | LM7805C.2 184.29,90.45 186.29,92.45 RBOTAO1.P$2 186.29,132.07 RBOTAO2.P$2 186.03,147.17 RBOTAO3.P$2 185.87,162.17 RBOTAO4.P$2 185.71,165.69 183.71,167.69 LM7805A.2 166,167.69 164,169.69 164,172.99 | U2.GND 73.61,178.14 SG1.- 85.51,187.45 PONTE-H-ESQUERDA.8 | TRILHA-GND.4 TRILHA-GND.5 143,186 | v99.21,159.46 PONTE-H-ESQUERDA.8
  Bottom 1: SHARP1.2 120.22,77.97 118.22,78 | 118.22,78 115,78 113,80 | 113,80 113,91.45 SHARP4.2 | 113,80 78.97,80 76.97,82 ARRAY.11 70.2,92.63 ARRAY-PEQUENO.5 55.55,94.1 53.55,96.1 RLED1.P$2 | RLED1.P$2 57.11,108.89 U1.GND@3 U1.GND@2 | RLED1.P$2 53.55,127.17 RLED2.P$2 53.39,137 | 53.39,137 53.39,148.17 RLED3.P$2 53.07,148.49 RLED4.P$2 56.67,169.33 66,160 71.61,160 73.61,162 U2.GND | SHARP2.2 47.43,137 53.39,137 | 118.22,78 124,78 127.61,81.61 10K.P$2 | PONTE-H-DIREITA.1 v99.21,159.46
  Bottom 1.27: M5.1 171.42,82.03 | 171.42,82.03 K1.2 | 171.42,82.03 174,84.61 174,89 172.55,90.45 LM7805C.2
  Bottom 2: LM7805B.2 161.08,185 166,185 172.97,191.97 J2.2 179.96,188.97 J2.3
M1A
  Bottom 1: PONTE-H-ESQUERDA.3 113.07,174.91 M1.1 113.07,188.73 M2.1
M1B
  Bottom 1: PONTE-H-ESQUERDA.4 111.07,175.45 M1.2 110.42,183.03 M2.2
M2A
  Bottom 1: PONTE-H-ESQUERDA.5 106.83,178.32 M3.1 104.12,183.73 M4.1
M2B
  Bottom 1: PONTE-H-ESQUERDA.6 104.27,177.23 M3.2 100.77,188.03 M4.2
N$1
  Top 1: LED1.K 48,88.9 46,90.9 46,105.26 RLED1.P$1
N$2
  Top 1: LED2.K 47.77,116.47 45.77,118.47 RLED2.P$1
N$3
  Top 1: LED3.K 47.61,156.96 45.61,154.96 RLED3.P$1
N$4
  Top 1: LED4.K 47.45,187.39 45.45,185.39 RLED4.P$1
N$5
  Bottom 1: HEADERPIN.3 17.47,158.97 R2.P$1 21.29,160.29 22,161 22,179.59 19.59,182 15,182 13.66,183.34 LED.A
N$6
  Top 1: R1.P$1 18.74,185.39 LED.K
N$7
  Bottom 1: HEADERPIN.1 9,154.49 9,166 10.8,167.8 R1.P$2 11.12,177.12 13,179 15,179 16,178 16,175.43 LDR.K
N$8
  Top 1: R2.P$2 15,164.12 15,170 13.66,171.34 LDR.A
  Bottom 1: HEADERPIN.2 14.93,156.53 R2.P$2
N$9
  Bottom 1: HEADERPIN1.3 17.47,104.97 R4.P$1 21.29,106.29 22,107 22,125.59 19.59,128 15,128 13.66,129.34 LED5.A
N$10
  Top 1: R3.P$1 18.74,131.39 LED5.K
N$11
  Bottom 1: HEADERPIN1.1 9,100.49 9,112 10.8,113.8 R3.P$2 11.12,123.12 13,125 15,125 16,124 16,121.43 LDR1.K
N$12
  Top 1: R4.P$2 15,110.12 15,116 13.66,117.34 LDR1.A
  Bottom 1: HEADERPIN1.2 14.93,102.53 R4.P$2
N$13
  Bottom 1: HEADERPIN2.3 17.47,51.97 R6.P$1 21.29,53.29 22,54 22,72.59 19.59,75 15,75 13.66,76.34 LED6.A
N$14
  Top 1: R5.P$1 18.74,78.39 LED6.K
N$15
  Bottom 1: HEADERPIN2.1 9,47.49 9,59 10.8,60.8 R5.P$2 11.12,70.12 13,72 15,72 16,71 16,68.43 LDR2.K
N$16
  Top 1: R6.P$2 15,57.12 15,63 13.66,64.34 LDR2.A
  Bottom 1: HEADERPIN2.2 14.93,49.53 R6.P$2
N$17
  Bottom 1: HEADERPIN3.3 63.03,25.47 R8.P$1 61.71,29.29 61,30 42.41,30 40,27.59 40,23 38.66,21.66 LED7.A
N$18
  Top 1: R7.P$1 36.61,26.74 LED7.K
N$19
  Bottom 1: HEADERPIN3.1 67.51,17 56,17 54.2,18.8 R7.P$2 44.88,19.12 43,21 43,23 44,24 46.57,24 LDR3.K
N$20
  Top 1: R8.P$2 57.88,23 52,23 50.66,21.66 LDR3.A
  Bottom 1: HEADERPIN3.2 65.47,22.93 R8.P$2
N$21
  Bottom 1: HEADERPIN4.3 63.03,49.47 R10.P$1 61.71,53.29 61,54 42.41,54 40,51.59 40,47 38.66,45.66 LED8.A
N$22
  Top 1: R9.P$1 36.61,50.74 LED8.K
N$23
  Bottom 1: HEADERPIN4.1 67.51,41 56,41 54.2,42.8 R9.P$2 44.88,43.12 43,45 43,47 44,48 46.57,48 LDR4.K
N$24
  Top 1: R10.P$2 57.88,47 52,47 50.66,45.66 LDR4.A
  Bottom 1: HEADERPIN4.2 65.47,46.93 R10.P$2
N$25
  Bottom 1: HEADERPIN5.3 116.03,48.47 R12.P$1 114.71,52.29 114,53 95.41,53 93,50.59 93,46 91.66,44.66 LED9.A
N$26
  Top 1: R11.P$1 89.61,49.74 LED9.K
N$27
  Bottom 1: HEADERPIN5.1 120.51,40 109,40 107.2,41.8 R11.P$2 97.88,42.12 96,44 96,46 97,47 99.57,47 LDR5.K
N$28
  Top 1: R12.P$2 110.88,46 105,46 103.66,44.66 LDR5.A
  Bottom 1: HEADERPIN5.2 118.47,45.93 R12.P$2
N$29
  Bottom 1: HEADERPIN6.3 116.03,25.47 R14.P$1 114.71,29.29 114,30 95.41,30 93,27.59 93,23 91.66,21.66 LED10.A
N$30
  Top 1: R13.P$1 89.61,26.74 LED10.K
N$31
  Bottom 1: HEADERPIN6.1 120.51,17 109,17 107.2,18.8 R13.P$2 97.88,19.12 96,21 96,23 97,24 99.57,24 LDR6.K
N$32
  Top 1: R14.P$2 110.88,23 105,23 103.66,21.66 LDR6.A
  Bottom 1: HEADERPIN6.2 118.47,22.93 R14.P$2
N$33
  Bottom 1: HEADERPIN7.3 170.03,48.47 R16.P$1 168.71,52.29 168,53 149.41,53 147,50.59 147,46 145.66,44.66 LED11.A
N$34
  Top 1: R15.P$1 143.61,49.74 LED11.K
N$35
  Bottom 1: HEADERPIN7.1 174.51,40 163,40 161.2,41.8 R15.P$2 151.88,42.12 150,44 150,46 151,47 153.57,47 LDR7.K
N$36
  Top 1: R16.P$2 164.88,46 159,46 157.66,44.66 LDR7.A
  Bottom 1: HEADERPIN7.2 172.47,45.93 R16.P$2
N$37
  Bottom 1: HEADERPIN8.3 170.03,25.47 R18.P$1 168.71,29.29 168,30 149.41,30 147,27.59 147,23 145.66,21.66 LED12.A
N$38
  Top 1: R17.P$1 143.61,26.74 LED12.K
N$39
  Bottom 1: HEADERPIN8.1 174.51,17 163,17 161.2,18.8 R17.P$2 151.88,19.12 150,21 150,23 151,24 153.57,24 LDR8.K
N$40
  Top 1: R18.P$2 164.88,23 159,23 157.66,21.66 LDR8.A
  Bottom 1: HEADERPIN8.2 172.47,22.93 R18.P$2
N$41
  Bottom 1.27: K1.O 152.33,78 172,78 174,80 M5.2
PWM3
  Bottom 1: PONTE-H-DIREITA.3 111.55,152.2 U1.3
PWM4
  Bottom 1: PONTE-H-DIREITA.4 114.09,152.2 U1.4
PWM5
  Bottom 1: PONTE-H-DIREITA.6 112.12,157.88 117,153 117,152.44 U1.5
PWM6
  Bottom 1: PONTE-H-DIREITA.7 114.66,158.34 119,154 119,152.24 U1.6
PWM8
  Top 1: SERVO3.3 125.77,171.24 U1.8
PWM9
  Top 1: SERVO4.3 127.92,152.46 U1.9
PWM10
  Top 1: U1.10 130.85,157 132.85,159 135,159 137,161 137,170.25 SERVO1.3
PWM11
  Top 1: SERVO2.3 139.63,157.63 137,155 134,155 133,154 133,152.46 U1.11
PWM12
  Bottom 1.27: K1.1 160.49,127.51 U1.12
SCL
  Top 1: U2.SCL 76.15,158.85 81,154 81,152.14 U1.21
SDA
  Top 1: U2.SDA 78.69,159.31 83,155 83,152.68 U1.20
VCC
  Top 2: J2.1 173.37,187.66 LM7805B.1 158.34,187.66 152,196 111,196 108,193 108,180 102,177 PONTE-H-ESQUERDA.7 | LM7805C.1 191,87.91 193,89.91 193,169 189.77,172.23 173.86,172.23
  Top 2.184: J2.1 173.86,172.23 171.86,170.23 LM7805A.1
  Bottom 1.27: K1.P 163,88 166,85
  Bottom 2: LM7805C.1 167.13,85 166,85 137,85 130.83,91.17 22K.P$1 127.08,100 124,100 121.71,102.29 U1.VIN
(copper drawn outside any net)
  shapes: Bottom area x2

### Text on the board
Top: LED | LDR | LED | LDR | LED | LDR | LED | LDR | LED | LDR | LED | LDR | LED | LDR | LED | LDR | LED | LDR
Bottom: 5V | GND | DADOS | 5V | GND | DADOS | GND | GND | GND | DADOS | DADOS | DADOS | 5V | GND | 5V | 5V | 5V | DADOS | GND | GND | GND | DADOS | DADOS | DADOS | 5V | 5V | 5V
bPlace: SESI ROBONATICOS - IPIRANGA | SESI ROBONATICOS - IPIRANGA | SESI ROBONATICOS - IPIRANGA | SESI ROBONATICOS - IPIRANGA | SESI ROBONATICOS - IPIRANGA | SESI ROBONATICOS - IPIRANGA | SESI ROBONATICOS - IPIRANGA | SESI ROBONATICOS - IPIRANGA | SESI ROBONATICOS - IPIRANGA | SESI ROBONATICOS - IPIRANGA